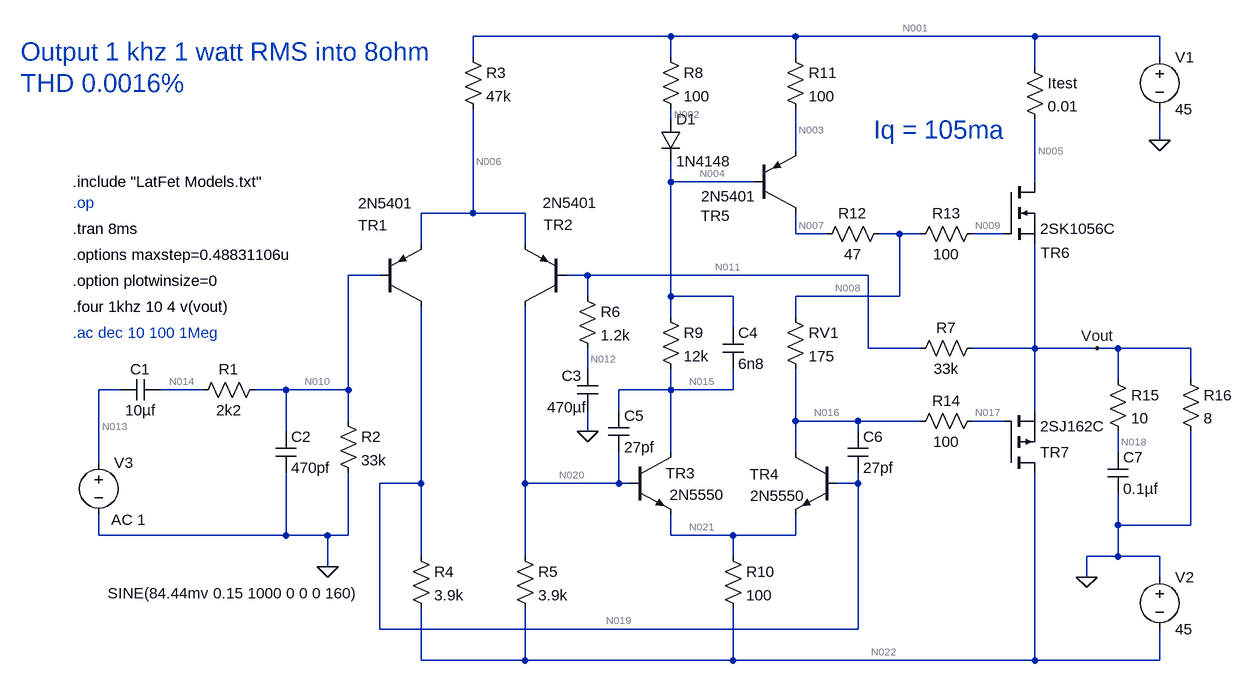
[diagram p0: schematic Maplin LatFet Amp.asc]
Maplin LatFet Amp.asc, the LTspice schematic file:
Version 4
SHEET 1 1412 908
WIRE 304 -192 0 -192
WIRE 496 -192 304 -192
WIRE 864 -192 496 -192
WIRE 1056 -192 864 -192
WIRE 0 -160 0 -192
WIRE 304 -160 304 -192
WIRE 496 -160 496 -192
WIRE 1056 -160 1056 -192
WIRE 864 -144 864 -192
WIRE 304 -64 304 -80
WIRE 1056 -32 1056 -80
WIRE 496 -16 496 -80
WIRE 304 32 304 0
WIRE 432 32 304 32
WIRE 864 32 864 -64
WIRE 0 80 0 -80
WIRE 0 80 -80 80
WIRE 80 80 0 80
WIRE 496 112 496 80
WIRE 544 112 496 112
WIRE 656 112 624 112
WIRE 688 112 656 112
WIRE 816 112 768 112
WIRE -80 128 -80 80
WIRE 80 128 80 80
WIRE -144 176 -192 176
WIRE 176 176 144 176
WIRE 608 176 176 176
WIRE 176 208 176 176
WIRE 304 208 304 32
WIRE 400 208 304 208
WIRE 656 208 656 112
WIRE 656 208 496 208
WIRE 304 240 304 208
WIRE 496 240 496 208
WIRE 400 256 400 208
WIRE 608 288 608 176
WIRE 688 288 608 288
WIRE 864 288 864 128
WIRE 864 288 768 288
WIRE 960 288 864 288
WIRE 992 288 960 288
WIRE 1104 288 992 288
WIRE 176 320 176 288
WIRE 992 336 992 288
WIRE 1104 336 1104 288
WIRE -544 352 -576 352
WIRE -416 352 -480 352
WIRE -288 352 -336 352
WIRE -192 352 -192 176
WIRE -192 352 -288 352
WIRE 304 352 304 320
WIRE 304 352 224 352
WIRE 400 352 400 320
WIRE 400 352 304 352
WIRE 224 384 224 352
WIRE 864 384 864 288
WIRE -192 400 -192 352
WIRE 496 400 496 320
WIRE 592 400 496 400
WIRE 688 400 592 400
WIRE 816 400 768 400
WIRE -288 416 -288 352
WIRE 176 416 176 384
WIRE 592 416 592 400
WIRE 304 448 304 352
WIRE 496 448 496 400
WIRE 992 448 992 416
WIRE -576 464 -576 352
WIRE -80 496 -80 224
WIRE -80 496 -144 496
WIRE 80 496 80 224
WIRE 224 496 224 448
WIRE 224 496 80 496
WIRE 240 496 224 496
WIRE 592 496 592 480
WIRE 592 496 560 496
WIRE 992 560 992 512
WIRE 1104 560 1104 416
WIRE 1104 560 992 560
WIRE -576 576 -576 544
WIRE -288 576 -288 480
WIRE -288 576 -576 576
WIRE -224 576 -288 576
WIRE -192 576 -192 480
WIRE -192 576 -224 576
WIRE 304 576 304 544
WIRE 400 576 304 576
WIRE 496 576 496 544
WIRE 496 576 400 576
WIRE -80 608 -80 496
WIRE 80 608 80 496
WIRE 400 608 400 576
WIRE 992 608 992 560
WIRE 992 608 944 608
WIRE 1056 608 992 608
WIRE -224 624 -224 576
WIRE 944 640 944 608
WIRE 1056 640 1056 608
WIRE -144 720 -144 496
WIRE 592 720 592 496
WIRE 592 720 -144 720
WIRE -80 768 -80 688
WIRE 80 768 80 688
WIRE 80 768 -80 768
WIRE 400 768 400 688
WIRE 400 768 80 768
WIRE 864 768 864 480
WIRE 864 768 400 768
WIRE 1056 768 1056 720
WIRE 1056 768 864 768
FLAG -224 624 0
FLAG 176 416 0
FLAG 1056 -32 0
FLAG 944 640 0
FLAG 960 288 Vout
DATAFLAG 1104 288 ""
SYMBOL res -16 -176 R0
SYMATTR InstName R3
SYMATTR Value 47k
SYMBOL res -96 592 R0
SYMATTR InstName R4
SYMATTR Value 3.9k
SYMBOL res 64 592 R0
SYMATTR InstName R5
SYMATTR Value 3.9k
SYMBOL res 480 -176 R0
SYMATTR InstName R11
SYMATTR Value 100
SYMBOL res 288 224 R0
SYMATTR InstName R9
SYMATTR Value 12k
SYMBOL res 784 96 R90
WINDOW 0 0 56 VBottom 2
WINDOW 3 32 56 VTop 2
SYMATTR InstName R13
SYMATTR Value 100
SYMBOL pnp 144 224 R180
WINDOW 0 -10 126 Left 2
WINDOW 3 -48 160 Left 2
SYMATTR InstName TR2
SYMATTR Value 2N5401
SYMBOL pnp -144 224 M180
WINDOW 0 -33 125 Left 2
WINDOW 3 -33 159 Left 2
SYMATTR InstName TR1
SYMATTR Value 2N5401
SYMBOL pnp 432 80 M180
WINDOW 0 -82 -4 Left 2
WINDOW 3 -81 26 Left 2
SYMATTR InstName TR5
SYMATTR Value 2N5401
SYMBOL npn 240 448 R0
WINDOW 3 62 65 Left 2
SYMATTR Value 2N5550
SYMATTR InstName TR3
SYMBOL npn 560 448 M0
WINDOW 3 49 67 Left 2
WINDOW 0 89 34 Left 2
SYMATTR Value 2N5550
SYMATTR InstName TR4
SYMBOL res 672 416 R270
WINDOW 0 32 56 VTop 2
WINDOW 3 0 56 VBottom 2
SYMATTR InstName R14
SYMATTR Value 100
SYMBOL nmos 816 32 R0
WINDOW 0 57 109 Left 2
SYMATTR InstName TR6
SYMATTR Value 2SK1056C
SYMBOL pmos 816 480 M180
SYMATTR InstName TR7
SYMATTR Value 2SJ162C
SYMBOL res 384 592 R0
SYMATTR InstName R10
SYMATTR Value 100
SYMBOL res 784 272 R90
WINDOW 0 0 56 VBottom 2
WINDOW 3 32 56 VTop 2
SYMATTR InstName R7
SYMATTR Value 33k
SYMBOL res 160 192 R0
SYMATTR InstName R6
SYMATTR Value 1.2k
SYMBOL voltage 1056 -176 R0
WINDOW 123 0 0 Left 2
WINDOW 39 0 0 Left 2
SYMATTR InstName V1
SYMATTR Value 45
SYMBOL voltage 1056 624 R0
WINDOW 123 0 0 Left 2
WINDOW 39 0 0 Left 2
SYMATTR InstName V2
SYMATTR Value 45
SYMBOL res 976 320 R0
SYMATTR InstName R15
SYMATTR Value 10
SYMBOL cap 976 448 R0
SYMATTR InstName C7
SYMATTR Value 0.1µf
SYMBOL res 1088 320 R0
SYMATTR InstName R16
SYMATTR Value 8
SYMBOL cap -304 416 R0
SYMATTR InstName C2
SYMATTR Value 470pf
SYMBOL cap 208 384 R0
SYMATTR InstName C5
SYMATTR Value 27pf
SYMBOL cap 576 416 R0
SYMATTR InstName C6
SYMATTR Value 27pf
SYMBOL voltage -576 448 R0
WINDOW 3 14 217 Left 2
WINDOW 123 19 104 Left 2
WINDOW 39 0 0 Left 2
SYMATTR Value SINE(84.44mv 0.15 1000 0 0 0 160)
SYMATTR Value2 AC 1
SYMATTR InstName V3
SYMBOL cap -480 336 R90
WINDOW 0 0 32 VBottom 2
WINDOW 3 32 32 VTop 2
SYMATTR InstName C1
SYMATTR Value 10µf
SYMBOL diode 288 -64 R0
SYMATTR InstName D1
SYMATTR Value 1N4148
SYMBOL res 288 -176 R0
SYMATTR InstName R8
SYMATTR Value 100
SYMBOL res 480 224 R0
SYMATTR InstName RV1
SYMATTR Value 175
SYMBOL cap 384 256 R0
SYMATTR InstName C4
SYMATTR Value 6n8
SYMBOL cap 160 320 R0
WINDOW 0 -24 10 Left 2
WINDOW 3 -16 43 Top 2
SYMATTR InstName C3
SYMATTR Value 470µf
SYMBOL res -208 384 R0
SYMATTR InstName R2
SYMATTR Value 33k
SYMBOL res -320 336 R90
WINDOW 0 0 56 VBottom 2
WINDOW 3 32 56 VTop 2
SYMATTR InstName R1
SYMATTR Value 2k2
SYMBOL res 640 96 R90
WINDOW 0 0 56 VBottom 2
WINDOW 3 32 56 VTop 2
SYMATTR InstName R12
SYMATTR Value 47
SYMBOL res 848 -160 R0
SYMATTR InstName Itest
SYMATTR Value 0.01
TEXT -616 64 Left 2 ;.op
TEXT -616 104 Left 2 !.tran 8ms
TEXT -616 144 Left 2 !.options maxstep=0.48831106u
TEXT -616 184 Left 2 !.option plotwinsize=0
TEXT -616 224 Left 2 !.four 1khz 10 4 v(vout)
TEXT -616 264 Left 2 ;.ac dec 10 100 1Meg
TEXT -696 -168 Left 4 ;Output 1 khz 1 watt RMS into 8ohm
TEXT -696 -120 Left 4 ;THD 0.0016%
TEXT 616 -48 Left 4 ;Iq = 105ma
TEXT -616 32 Left 2 !.include "LatFet Models.txt"

The netlist it stands for:
* Maplin LatFet Amp.asc
R3 N001 N006 47k
R4 N019 N022 3.9k
R5 N020 N022 3.9k
R11 N001 N003 100
R9 N004 N015 12k
R13 N009 N008 100
Q§TR2 N020 N011 N006 0 2N5401
Q§TR1 N019 N010 N006 0 2N5401
Q§TR5 N007 N004 N003 0 2N5401
Q§TR3 N015 N020 N021 0 2N5550
Q§TR4 N016 N019 N021 0 2N5550
R14 N016 N017 100
M§TR6 N005 N009 Vout Vout 2SK1056C
M§TR7 N022 N017 Vout Vout 2SJ162C
R10 N021 N022 100
R7 Vout N011 33k
R6 N011 N012 1.2k
V1 N001 0 45
V2 0 N022 45
R15 Vout N018 10
C7 N018 0 0.1µf
R16 Vout 0 8
C2 N010 0 470pf
C5 N015 N020 27pf
C6 N016 N019 27pf
V3 N013 0 SINE(84.44mv 0.15 1000 0 0 0 160) AC 1
C1 N014 N013 10µf
D1 N002 N004 1N4148
R8 N001 N002 100
RV1 N008 N016 175
C4 N004 N015 6n8
C3 N012 0 470µf
R2 N010 0 33k
R1 N010 N014 2k2
R12 N008 N007 47
R§Itest N001 N005 0.01
.model D D
.lib standard.dio
.model NPN NPN
.model PNP PNP
.lib standard.bjt
.model NMOS NMOS
.model PMOS PMOS
.lib standard.mos
* .op
.tran 8ms
.options maxstep=0.48831106u
.option plotwinsize=0
.four 1khz 10 4 v(vout)
* .ac dec 10 100 1Meg
* Output 1 khz 1 watt RMS into 8ohm
* THD 0.0016%
* Iq = 105ma
.include "LatFet Models.txt"
.backanno
.end

* Results of the author's LTspice run, read from the files saved beside the schematic
* Operating Point, zero values left out:
*   V(n001) = 45 V
*   V(n002) = 44.51 V
*   V(n003) = 44.52 V
*   V(n004) = 43.85 V
*   V(n005) = 45 V
*   V(n006) = 705.6 mV
*   V(n007) = 667.4 mV
*   V(n008) = 443.3 mV
*   V(n009) = 443.3 mV
*   V(n010) = 99.23 mV
*   V(n011) = 98.95 mV
*   V(n012) = 98.95 mV
*   V(n013) = 84.44 mV
*   V(n014) = 99.23 mV
*   V(n015) = -15.05 V
*   V(n016) = -390.9 mV
*   V(n017) = -390.9 mV
*   V(n018) = -1.306 mV
*   V(n019) = -43.3 V
*   V(n020) = -43.3 V
*   V(n021) = -44.03 V
*   V(n022) = -45 V
*   V(vout) = -1.306 mV
*   I(D1) = 4.88 mA
*   I(Itest) = 104.5 mA
*   I(R10) = 9.74 mA
*   I(R11) = 4.795 mA
*   I(R12) = -4.767 mA
*   I(R16) = -163.2 µA
*   I(R2) = 3.007 µA
*   I(R3) = 942.4 µA
*   I(R4) = 435 µA
*   I(R5) = 436 µA
*   I(R7) = -3.038 µA
*   I(R8) = 4.88 mA
*   I(R9) = 4.908 mA
*   I(RV1) = 4.767 mA
*   I(V1) = -115.1 mA
*   I(V2) = -115.3 mA
*   Ib(TR1) = -3.007 µA
*   Ib(TR2) = -3.038 µA
*   Ib(TR3) = 34.76 µA
*   Ib(TR4) = 30.64 µA
*   Ib(TR5) = -28.65 µA
*   Ic(TR1) = -465.7 µA
*   Ic(TR2) = -470.7 µA
*   Ic(TR3) = 4.908 mA
*   Ic(TR4) = 4.767 mA
*   Ic(TR5) = -4.767 mA
*   Id(TR6) = 104.5 mA
*   Id(TR7) = -104.7 mA
*   Ie(TR1) = 468.7 µA
*   Ie(TR2) = 473.8 µA
*   Ie(TR3) = -4.943 mA
*   Ie(TR4) = -4.797 mA
*   Ie(TR5) = 4.795 mA
*   Is(TR6) = -104.5 mA
*   Is(TR7) = 104.7 mA
* From the log:
*   Fourier components of  v(vout)
*   N-Period=4
*   DC component:-0.00414395
*   Harmonic  Frequency   Fourier   Normalized   Phase    Normalized
*    Number     [Hz]     Component   Component  [degree]  Phase [deg]
*       1      1.000e+03   4.005e+00   1.000e+00     90.33°      0.00°
*       2      2.000e+03   4.829e-05   1.206e-05   -100.84°   -191.17°
*       3      3.000e+03   3.435e-05   8.578e-06     16.43°    -73.90°
*       4      4.000e+03   1.418e-05   3.541e-06    -76.49°   -166.82°
*       5      5.000e+03   1.961e-05   4.896e-06      9.25°    -81.08°
*       6      6.000e+03   6.607e-06   1.650e-06    100.61°     10.28°
*       7      7.000e+03   2.569e-06   6.414e-07     -1.41°    -91.74°
*       8      8.000e+03   1.029e-05   2.569e-06     97.88°      7.55°
*       9      9.000e+03   4.544e-06   1.135e-06   -167.90°   -258.23°
*      10      1.000e+04   2.198e-06   5.488e-07     96.98°      6.65°
*   Partial Harmonic Distortion: 0.001633%
*   Total Harmonic Distortion:   0.001692%